# EAGLE design Gadget-Box-ESP8266 (EAGLE 6.6.0)

## Sheet 1 of 2
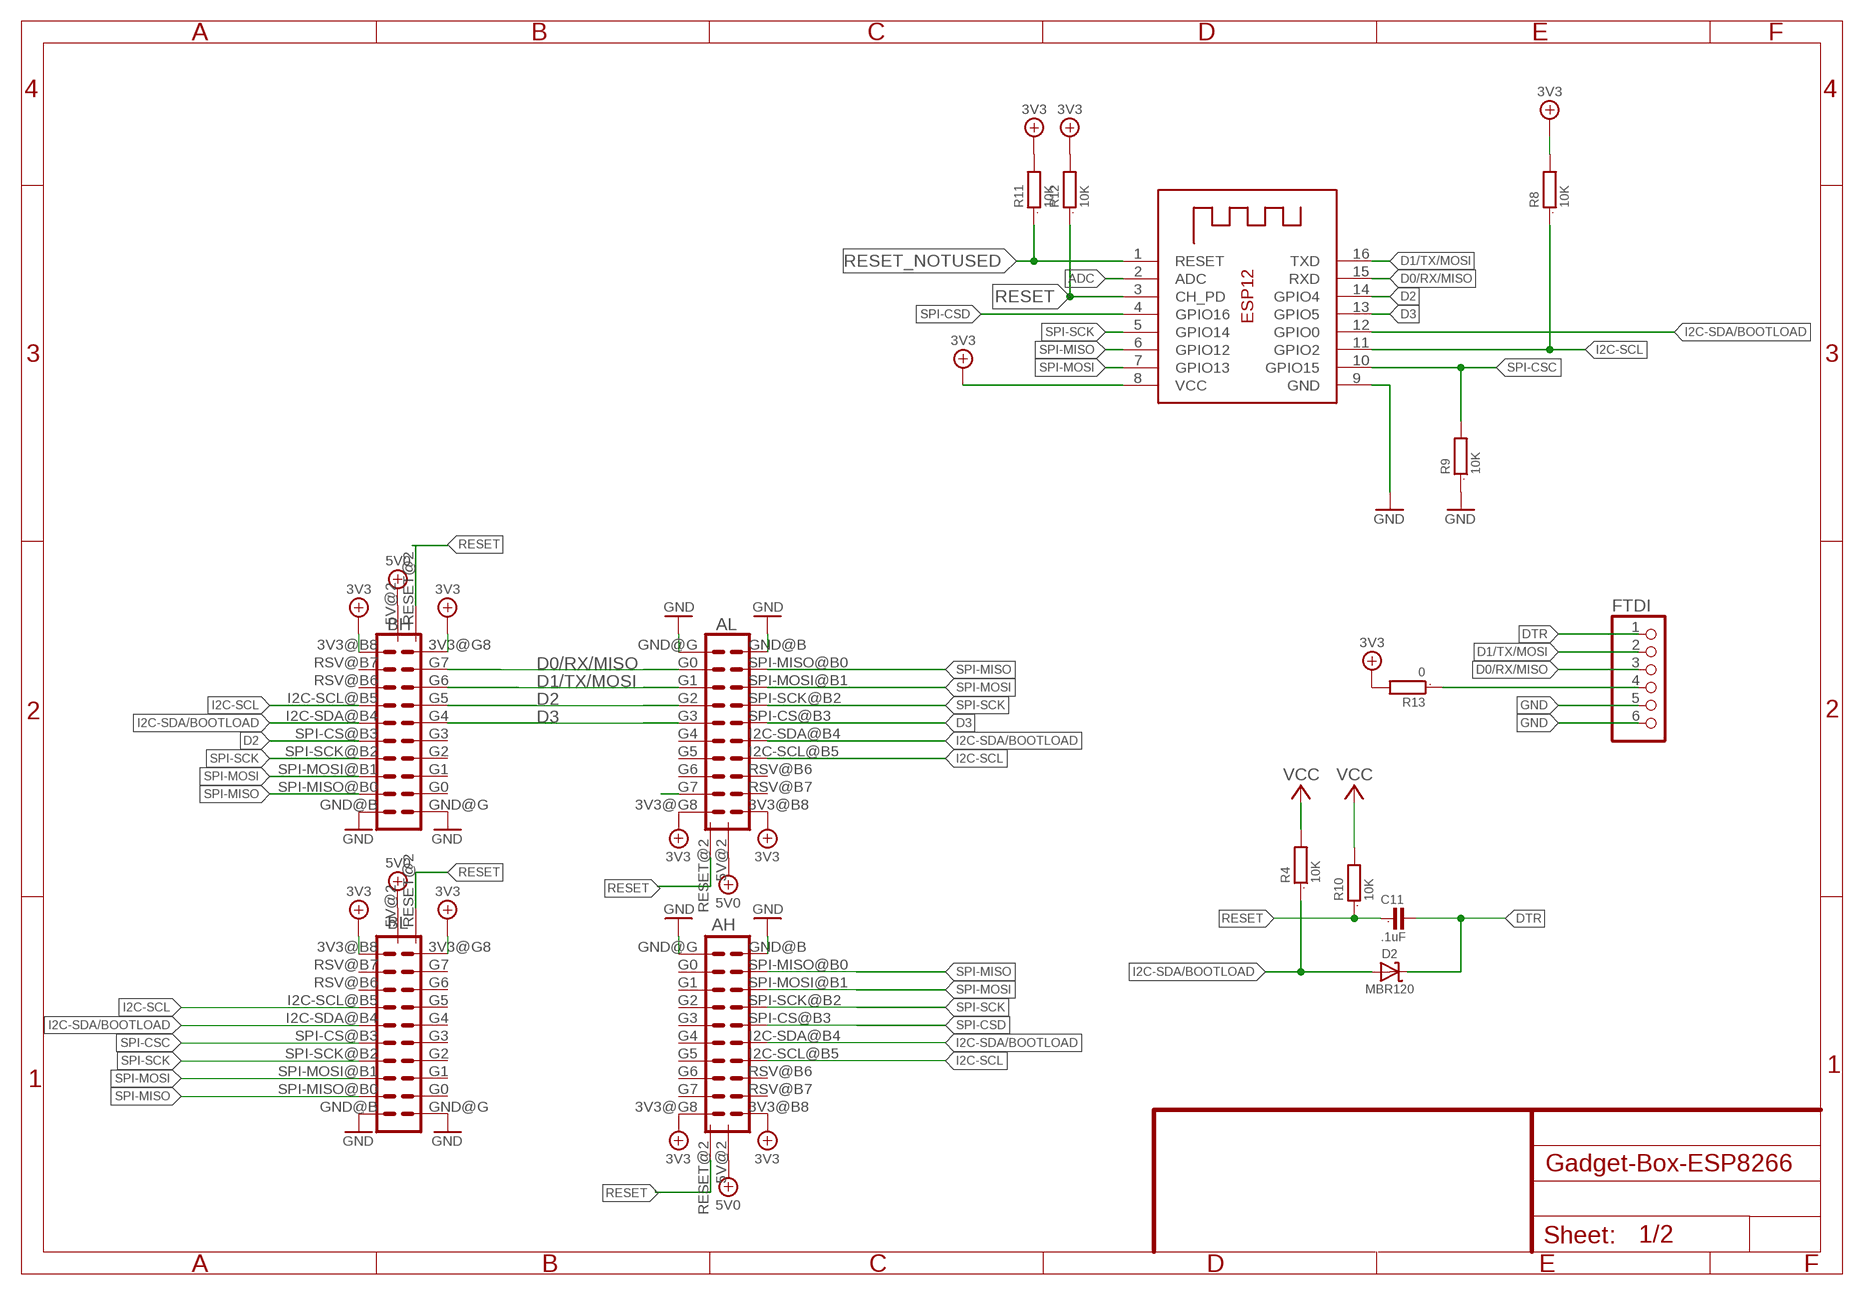
[diagram p0: schematic, sheet 1]

### Parts
AH  ECOGECOG_SLOT_ALT1  [ECOG_ALT1]
AL  ECOGECOG_SLOT_ALT1  [ECOG_ALT1]
BH  ECOGECOG_SLOT_ALT1  [ECOG_ALT1]
BL  ECOGECOG_SLOT_ALT1  [ECOG_ALT1]
C11  .1uF  C0805  [0805]
D2  MBR120  DIODE-SCHOTTKYSOD-123  [SOD-123]
FTDI  PINHD-1X6  [1X06]
R4  10K  R0805  [0805]
R8  10K  R0805  [0805]
R9  10K  R0805  [0805]
R10  10K  R0805  [0805]
R11  10K  R0805  [0805]
R12  10K  R0805  [0805]
R13  0  R0805  [0805]
X2  ESP-12  [ESP-12]

### Nets
3V3: AH.3V3@B8(3V3) AH.3V3@G8(3V3) AL.3V3@B8(3V3) AL.3V3@G8(3V3) BH.3V3@B8(3V3) BH.3V3@G8(3V3) BL.3V3@B8(3V3) BL.3V3@G8(3V3) R8.2 R10.2 R11.2 R12.2 R13.2 X2.8(VCC) ; supply symbol labelled VCC ; also sheet 2
5V0: AH.5V@2(5V) AL.5V@2(5V) BH.5V@2(5V) BL.5V@2(5V) ; also sheet 2
ADC: X2.2(ADC) ; also sheet 2
D0/RX/MISO: AL.G0 BH.G7 FTDI.3 X2.15(RXD)
D1/TX/MOSI: AL.G1 BH.G6 FTDI.2 X2.16(TXD)
D2: AL.G2 BH.G5 BH.SPI-CS@B3(SPI-CS) X2.14(GPIO4)
D3: AL.G3 AL.SPI-CS@B3(SPI-CS) BH.G4 X2.13(GPIO5)
DTR: C11.2 D2.C FTDI.1
GND [gnd]: AH.GND@B(GND) AH.GND@G(GND) AL.GND@B(GND) AL.GND@G(GND) BH.GND@B(GND) BH.GND@G(GND) BL.GND@B(GND) BL.GND@G(GND) FTDI.5 FTDI.6 R9.1 X2.9(GND) ; also sheet 2
I2C-SCL: AH.I2C-SCL@B5(I2C-SCL) AL.I2C-SCL@B5(I2C-SCL) BH.I2C-SCL@B5(I2C-SCL) BL.I2C-SCL@B5(I2C-SCL) R8.1 X2.11(GPIO2)
I2C-SDA/BOOTLOAD: AH.I2C-SDA@B4(I2C-SDA) AL.I2C-SDA@B4(I2C-SDA) BH.I2C-SDA@B4(I2C-SDA) BL.I2C-SDA@B4(I2C-SDA) D2.A R4.1 X2.12(GPIO0)
N$5: AL.G7
N$6: FTDI.4 R13.1
RESET: AH.RESET@2(RESET) AL.RESET@2(RESET) BH.RESET@2(RESET) BL.RESET@2(RESET) C11.1 R10.1 R12.1 X2.3(CH_PD)
RESET_NOTUSED: R11.1 X2.1(RESET)
SPI-CSC: BL.SPI-CS@B3(SPI-CS) R9.2 X2.10(GPIO15)
SPI-CSD: AH.SPI-CS@B3(SPI-CS) X2.4(GPIO16)
SPI-MISO: AH.SPI-MISO@B0(SPI-MISO) AL.SPI-MISO@B0(SPI-MISO) BH.SPI-MISO@B0(SPI-MISO) BL.SPI-MISO@B0(SPI-MISO) X2.6(GPIO12)
SPI-MOSI: AH.SPI-MOSI@B1(SPI-MOSI) AL.SPI-MOSI@B1(SPI-MOSI) BH.SPI-MOSI@B1(SPI-MOSI) BL.SPI-MOSI@B1(SPI-MOSI) X2.7(GPIO13)
SPI-SCK: AH.SPI-SCK@B2(SPI-SCK) AL.SPI-SCK@B2(SPI-SCK) BH.SPI-SCK@B2(SPI-SCK) BL.SPI-SCK@B2(SPI-SCK) X2.5(GPIO14)
VCC: R4.2
Unconnected: AH.G0 AH.G1 AH.G2 AH.G3 AH.G4 AH.G5 AH.G6 AH.G7 AH.RSV@B6(RSV) AH.RSV@B7(RSV) AL.G4 AL.G5 AL.G6 AL.RSV@B6(RSV) AL.RSV@B7(RSV) BH.G0 BH.G1 BH.G2 BH.G3 BH.RSV@B6(RSV) BH.RSV@B7(RSV) BL.G0 BL.G1 BL.G2 BL.G3 BL.G4 BL.G5 BL.G6 BL.G7 BL.RSV@B6(RSV) BL.RSV@B7(RSV)

## Sheet 2 of 2
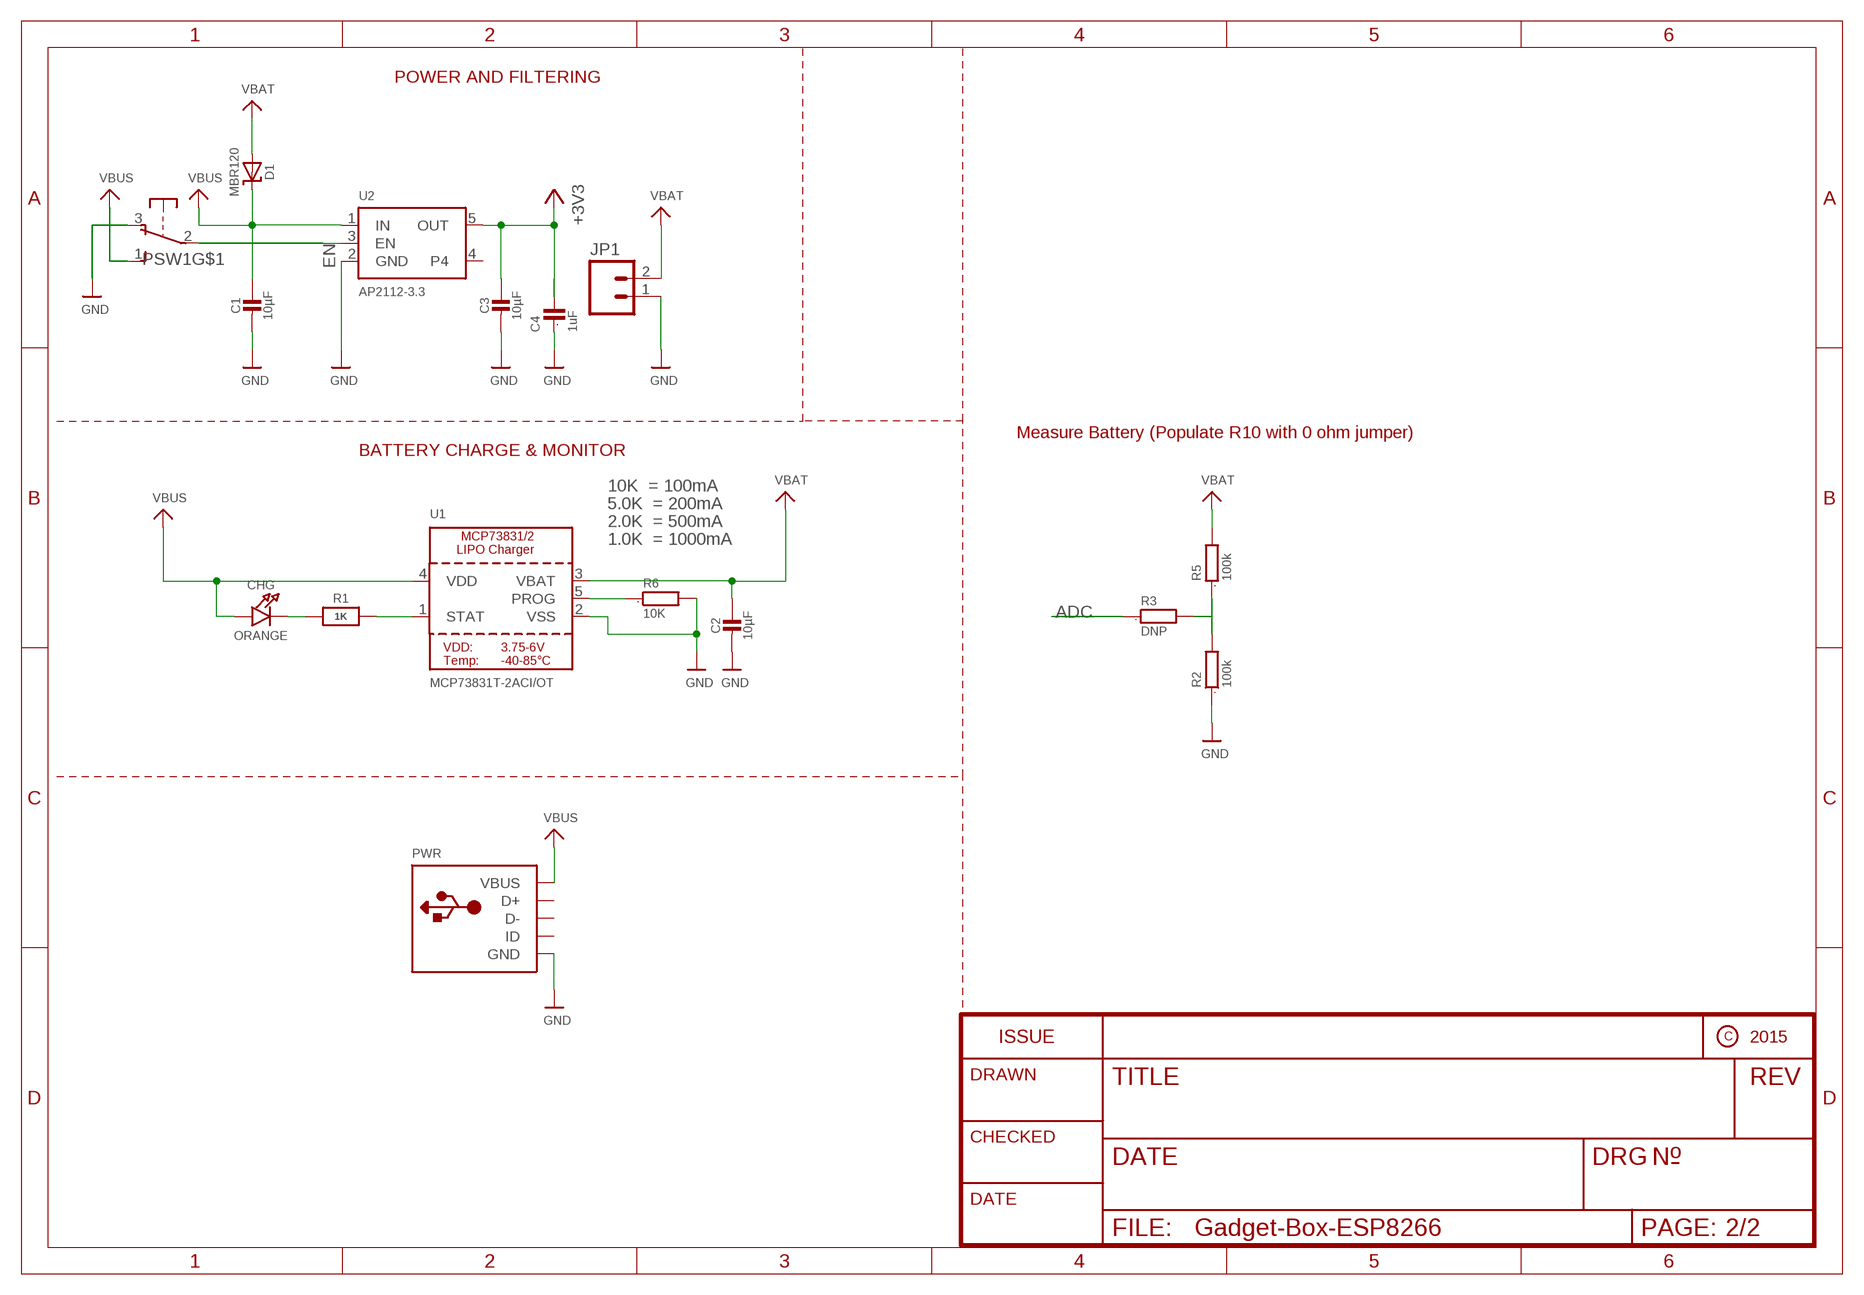
[diagram p1: schematic, sheet 2]

### Parts
C1  10µF  CAP_CERAMIC0805-NOOUTLINE  [0805-NO]
C2  10µF  CAP_CERAMIC0805-NOOUTLINE  [0805-NO]
C3  10µF  CAP_CERAMIC0805-NOOUTLINE  [0805-NO]
C4  1uF  C0603  [0603]
CHG  ORANGE  LED0805_NOOUTLINE  [CHIPLED_0805_NOOUTLINE]
D1  MBR120  DIODE-SCHOTTKYSOD-123  [SOD-123]
JP1  M02-JST-2-PTH-NO_SILK  [JST-2-PTH-NS]
PSW1  OS102011MA1Q  [OS102011MA1Q]
PWR  USBMINIB  [USB-MINIB]
R1  1K  RESISTOR_0603_NOOUT  [0603-NO]
R2  100k  R0603  [0603]
R3  DNP  R0603  [0603]
R5  100k  R0603  [0603]
R6  10K  R0603  [0603]
U1  MCP73831T-2ACI/OT  MCP73831/2  [SOT23-5]
U2  AP2112-3.3  VREG_SOT23-5  [SOT23-5]

### Nets
3V3: C3.1 C4.2 U2.5(OUT) ; supply symbol labelled +3V3 ; also sheet 1
5V0: C1.1 CHG.A D1.C PSW1.1(S) PWR.VBUS U1.4(VDD) U2.1(IN) ; supply symbol labelled VBUS ; also sheet 1
ADC: R3.1 ; also sheet 1
EN: PSW1.2(P) U2.3(EN)
GND [gnd]: C1.2 C2.2 C3.2 C4.1 JP1.1 PSW1.3(O) PWR.GND R2.1 R6.2 U1.2(VSS) U2.2(GND) ; also sheet 1
N$1: CHG.C R1.1
N$2: R2.2 R3.2 R5.1
N$3: R1.2 U1.1(STAT)
N$4: R6.1 U1.5(PROG)
VBAT: C2.1 D1.A JP1.2 R5.2 U1.3(VBAT)
Unconnected: PSW1.MT1(MT) PSW1.MT2(MT) PWR.D+ PWR.D- PWR.ID U2.4

### Notes on the sheet
- POWER AND FILTERING
- Measure Battery (Populate R10 with 0 ohm jumper)
- BATTERY CHARGE & MONITOR
- 10K  = 100mA
- 5.0K  = 200mA
- 2.0K  = 500mA
- 1.0K  = 1000mA

## Library data of the parts
AH AL BH BL = eCogs:ECOG; PARTNO: PPPC102LFBN-RC,SULLINS CONNECTOR SOLUTIONS,dk,S6106-ND,"CONN HEADER FEM 20POS.1"" DL GOLD", REF67
C1-C3 = microbuilder:CAP_CERAMIC: Ceramic Capacitors For new designs, use the packages preceded by an '_' character since they are more reliable: The following footprints should be used on most boards: _0402 - Standard footprint for regular board layouts _0603 - Standard footprint for regular board layouts _0805 - Standard footprint for regular board layouts _1206 - Standard footprint for regular board layouts For extremely tight-pitch boards where space is at a premium, the following 'micro-pitch' footprints can be used (smaller pads, no silkscreen outline, etc.): _0402MP - Micro-pitch footprint for very dense/compact boards _0603MP - Micro-pitch footprint for very dense/compact boards _0805MP - Micro-pitch footprint for very dense/compact boards _1206MP - Micro-pitch footprint for very dense/compact boards; PARTNO: CL21F106ZPFNNNE,Samsung,DK,1276-3012-1-ND,CAP CER 10UF 10V Y5V 0805, REF1
C4 = GadgetFactory:C: CAPACITOR, European symbol; PARTNO: C1608X5R1A105K080AC,TDK CORPORATION (VA),dk,445-1321-1-ND,CAP CER 1UF 10V X5R 0603, REF53
C11 = GadgetFactory:C: CAPACITOR, European symbol; PARTNO: GRM21BR71E104KA01L,MURATA ELECTRONICS (VA),DK,490-1673-1-ND,CAP CER .1UF 25V 10% X7R 0805, REF3
CHG = microbuilder:LED: LED 0603 - 0603 Surface Mount Package 2mA: Green LED - Low Power (3.9mcd, 2ma, 1.7Vf) - Digikey: 475-2709-2-ND Orange LED - Low Power (9.8mcd, 2ma, 1.8Vf) - Digikey: 475-1194-2-ND Red LED - Low Power (5mcd, 2ma, 1.8Vf) - Digikey: 475-1195-2-ND Yellow LED - Low Power (7mcd, 2ma, 1.8Vf) - Digikey: 475-1196-2-ND 5mA: Blue LED - Low Power (17mcd, 5ma, 2.9Vf) - Digikey: LNJ937W8CRACT-ND 0805 - 0805 Surface Mount Package 2mA: Red LED (8.8mcd, 2mA, 1.8Vf, Clear) - Low Power [Digikey: 475-2510-1-ND] Green LED (5mcd, 2mA, 1.8Vf, Clear) - Low Power [Digikey: 475-2730-1-ND] Yellow LED (11.3mcd, 2mA, 1.8Vf, Clear) - Low Power [Digikey: 475-2555-1-ND] 20mA: Red LED (104mcd, 20mA, Diffused) - LS R976 [Digikey: 475-1278-6-ND] Red LED (12mcd, 20mA, 2.0Vf, Clear) - APT2012EC [Digikey: 754-1128-1-ND] Green LED (15mcd, 20mA, 2.2Vf, Clear) - APT2012GC [Digikey: 754-1131-1-ND] Orange LED (160mcd, 20mA, 2.1Vf, Clear) - APT2012SECK [Digikey: 754-1130-1-ND] 1206 - 1206 Surface Mount Package Green LED (26mcd, 20mA, Diffused) - LG N971 [Digikey: 475-1407-6-ND] Red LED (15mcd, 20mA, Diffused) - LH N974 [Digikey: 475-1416-6-ND] Cree - Cree High-Power Surface Mount LEDs XPEBWT-L1-0000-00D50 - White 111lm 350mA 2.9Vf 6200K 110° XTEAWT-00-0000-00000LEE3 - White 114lm 350mA 2.85Vf 5000K 115° Everlight - Everlight 45-21 Series Surface Mount LEDs 45-21/QK2C-B2832AC2CB2/2T - Warm White 2000mcd 20mA 3.25Vf 3050K 120° 45-21/LK2C-B38452C4CB2/2T - Nuetral White 2000mcd 20mA 3.25Vf 4150K 120° 45-21/LK2C-B50634C6CB2/2T - Cold White 2200mcd 20mA 3.25Vf 5650K 120° PLCC2 Reverse Mount LS T77K-J1L2-1-0-2-R18-Z - Red 11.25mcd 2mA 1.8Vf 630nm 120° LO T77K-L1M2-24-Z - Orange 19.6mcd 2mA 1.8Vf 606nm 120° LY T77K-K2M1-26-Z - Yellow 15.7mcd 2mA 1.8Vf 587nm 120°; PARTNO: LTST-C171EKT,LITE-ON INC (VA),DK,160-1422-1-ND,LED RED ORAN CLEAR THIN 0805 SMD, REF6
D1 D2 = microbuilder:DIODE-SCHOTTKY; PARTNO: MBR120VLSFT3G,on semiconductor,dk,MBR120VLSFT3GOSCT-ND ,DIODE SCHOTTKY 20V 1A SOD123FL , REF71
FTDI = GadgetFactory:PINHD-1X6: PIN HEADER; PARTNO: PPPC061LGBN-RC,SULLINS CONNECTOR SOLUTIONS,dk,S5481-ND ,"6 Position Header Connector 0.100"" (2.54mm) Through Hole - Right Angle Gold ", REF91
JP1 = SparkFun:M02: Header 2 Standard 2-pin 0.1" header. Use with straight break away headers (SKU : PRT-00116), right angle break away headers (PRT-00553), swiss pins (PRT-00743), machine pins (PRT-00117), and female headers (PRT-00115). Molex polarized connector foot print use with SKU : PRT-08233 with associated crimp pins and housings.; PARTNO: B2B-PH-SM4-TB(LF)(SN),JST SALES AMERICA INC (VA),dk,455-1734-1-ND ,"2 Positions Header, Shrouded Connector 0.079 (2.00mm) Through Hole Tin ", REF87
PSW1 = adafruit:OS102011MA1Q: OS10201MA1Q through-hole right angle switch http://www.ladyada.net/library/eagle; PARTNO: OS102011MA1QN1,C&K Components,dk,CKN9559-ND,SWITCH SLIDE SPDT 100MA 12V , REF72
PWR = adafruit:USB: USB Connectors USBMINIB - Surface Mount Female Mini-B USB Connector 4UConnector: 06564 By microbuilder.eu Thru-hole RA Female Mini-B USB Connector 4UConnector: 18732 By ladyada.net; PARTNO: USB-M26FTR,On Shore Technology Inc,DK,ED2992CT-ND,MINI-USB-B Connector, REF22
R1 = microbuilder:RESISTOR: Resistors For new designs, use the packages preceded by an '_' character since they are more reliable: The following footprints should be used on most boards: _0402 - Standard footprint for regular board layouts _0603 - Standard footprint for regular board layouts _0805 - Standard footprint for regular board layouts _1206 - Standard footprint for regular board layouts For extremely tight-pitch boards where space is at a premium, the following 'micro-pitch' footprints can be used (smaller pads, no silkscreen outline, etc.): _0402MP - Micro-pitch footprint for very dense/compact boards _0603MP - Micro-pitch footprint for very dense/compact boards _0805MP - Micro-pitch footprint for very dense/compact boards _1206MP - Micro-pitch footprint for very dense/compact boards; PARTNO: RC0603JR-071KL,YAGEO (VA),dk,311-1.0KGRTR-ND,RES SMD 1K OHM 5% 1/10W 0603 , REF73
R2 R5 = GadgetFactory:R: RESISTOR, European symbol; PARTNO: RC0603JR-07100KL,YAGEO (VA),dk,311-100KGRCT-ND,RES SMD 100K OHM 5% 1/10W 0603 , REF76
R3 R13 = GadgetFactory:R: RESISTOR, European symbol; BOM: EXCLUDE
R4 R6 R10 = GadgetFactory:R: RESISTOR, European symbol; PARTNO: RC0603JR-0710KL,YAGEO (VA),dk,311-10KGRCT-ND,RES SMD 10K OHM 5% 1/10W 0603 , REF36
R8 R9 R11 R12 = GadgetFactory:R: RESISTOR, European symbol; DIGIKEY: RMCF0805JT10K0CT-ND
U1 = microbuilder:MCP73831/2: MCP73831/2 LIPO Charger VDD: 3.75 - 6V Temp -40 - 85°C Programmable Charge Rate: 15-500mA NOTE: STAT is a tri-state logic output on the MCP73831 and an open-drain output on the MCP73832. SOT23-5 with 4.2V output and tri-state logic on STAT = MCP73831T-2ACI/OT; PARTNO: MCP73831T-2ACI/OT,MICROCHIP TECHNOLOGY (VA),dk,MCP73831T-2ACI/OTCT-ND,IC CONTROLLR LI-ION 4.2V SOT23-5, REF74
U2 = microbuilder:VREG_SOT23-5: SOT23-5 Fixed Voltage Regulators Part Current Out V Out V In V Dropout θJA (°C/W) TJ (°C) Digikey Part No. ADP121 150mA 3.3V 3.4-5.5V 0.09V @ 150mA -- -- ADP121-AUJZ33R7CT-ND ADP121 150mA 3.0V 3.1-5.5V 0.09V @ 150mA -- -- ADP121-AUJZ30R7CT-ND ADP122 300mA 3.3V 3.4-5.5V 0.085V @ 300mA -- -- ADP122AUJZ-3.3-R7CT-ND ADP1712 300mA 3.3V 3.5-5.5V 0.17V @ 300mA -- -- ADP1712AUJZ-3.3-R7TR-ND AP7311 (Low Cost) 150mA 3.3V 3.5-6V 0.15V @ 150mA -- -- AP7311-33WG-7DICT-ND LD39015M18R 150mA 1.8V 1.9V-5.5V 0.08V @ 100mA -- -- 497-6977-1-ND LP2985A-33DBVR 150mA 3.3V 3.3-16V 0.28V @ 150mA 206 150 296-18479-1-ND MCP1824T-3302E/OT 300mA 3.3V 3.5V-6V 0.2V @ 300mA -- -- MCP1824T-3302E/OTCT-ND MIC5205-2.5YM5 TR 150mA 2.5V 2.7-16V 0.165V @ 150mA -- -- 576-1257-2-ND MIC5205-3.0YM5 TR 150mA 3.0V 3.2V-16V 0.165V @ 150mA -- -- 576-1258-2-ND MIC5205-3.3YM5 TR 150mA 3.3V 3.5V-16V 0.165V @ 150mA -- -- 576-1259-2-ND TPS780330220 150mA 3.3V+2.2V 3.6-5.5V 250mV Max -- -- 296-23332-1-ND TDA3663/N1,135 100mA 3.3V 3.5-45V 0.18V @ 50mA -- -- 568-5343-1-ND Max operating temp can be calculated using θJA, TJ (max junction temperature), and power in watts. Set the "Maximum Ambient Temperature" until it reaches TJ ("Max Junction Temperature"), which is the absolute limit for safe use of the regulator: Heat Sink Temperature Calculator <http://www.daycounter.com/Calculators/Heat-Sink-Temperature-Calculator.phtml> For example, With 12V source into a 3.3V LP2985 and a 30mA load, we are dissipating (12V-3.3V) * 0.03A = 0.261W. With a θJA of 206 °C/W, a TJ of 150°C, and 261mW we can safely use the chip without a heat sink up to 75°C (=147.1°C Junction Temperature).; PARTNO: AP2112K-3.3TRG1,Diodes Incorporated,dk,AP2112K-3.3TRG1DICT-ND,IC REG LDO 3.3V 0.6A SOT25 , REF75
X2 = adafruit:ESP-12; ADAFRUIT: 2491

## Net classes
2 gnd: width 0.254 mm, drill 0.381 mm, clearance 0.254 mm
3 usbvcc: width 0.254 mm, drill 0.381 mm, clearance 0.254 mm
4 aref: width 0.254 mm, drill 0.381 mm, clearance 0.254 mm

## Board
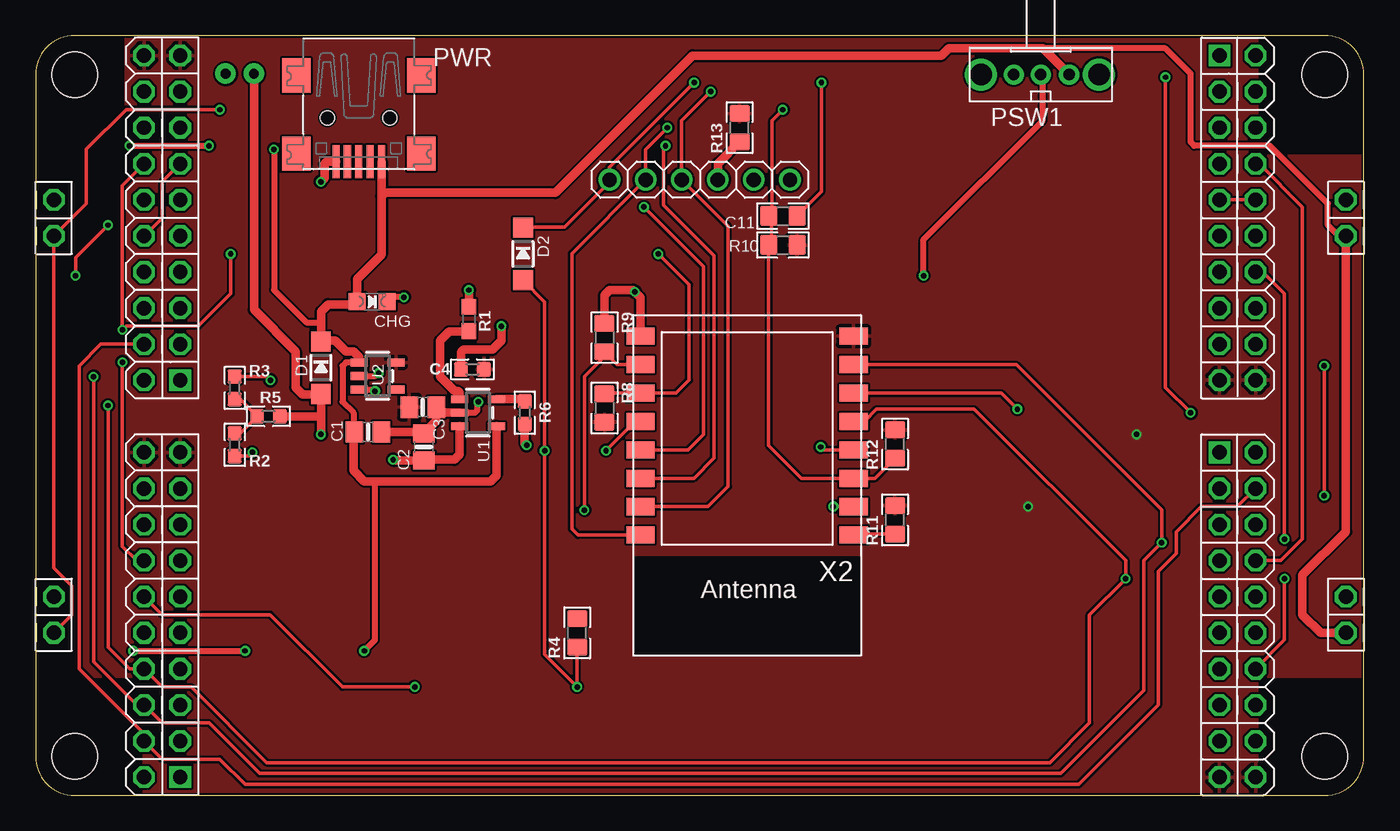
[diagram p2: board, top side]
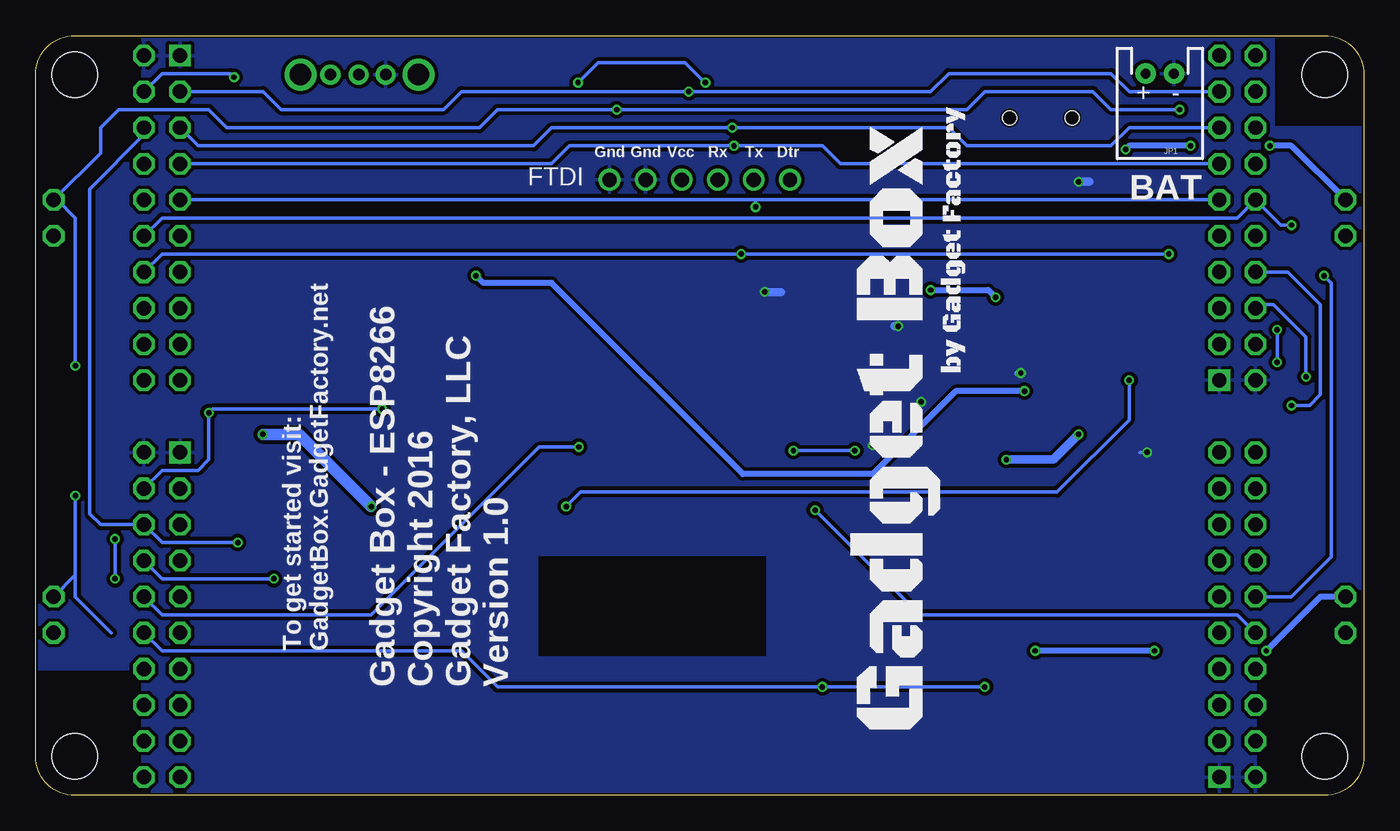
[diagram p3: board, bottom side, seen from below]

Size 93.5 x 53.5 mm. Coordinates in mm from the lower left corner, seen from the top.
Copper layers (1*16): Top 0.035mm / dielectric 1.5mm / Bottom 0.035mm
Design rules "hackvana *": minimum track width 6mil, minimum drill 0.3mm, track to track 6mil, track to pad 6mil, pad to pad 6mil, via to via 6mil, smd to smd 0mil, copper to edge 6mil, drill to drill 6mil, minimum pad ring 10mil, minimum via ring 6mil, stop-mask expansion 2mil, vias tented up to drill 100mil, thermal gap 10mil

### Footprints (pad centres in the part's own frame; a part is rotated, then mirrored left to right if it is on the bottom)
ECOG93P53P5 = hole 3.2: 4,4; 92,4; 92,52; 4,52
ECOG_ALT1 = drill 1.016 octagon: 3V3@B8 21.59,3.81; 3V3@G8 21.59,1.27; 5V@2 11.43,10.16; G0 1.27,1.27; G1 3.81,1.27; G2 6.35,1.27; G3 8.89,1.27; G4 11.43,1.27; G5 13.97,1.27; G6 16.51,1.27; G7 19.05,1.27; GND@B -1.27,3.81; I2C-SCL@B5 13.97,3.81; I2C-SDA@B4 11.43,3.81; RESET@2 8.89,10.16; RSV@B6 16.51,3.81; RSV@B7 19.05,3.81; SPI-CS@B3 8.89,3.81; SPI-MISO@B0 1.27,3.81; SPI-MOSI@B1 3.81,3.81; SPI-SCK@B2 6.35,3.81 | drill 1.016 square: GND@G -1.27,1.27
0805-NO = smd 1.24 x 1.5: 1 -0.95,0; 2 0.95,0
0603 = smd 1 x 1: 1 -0.8,0; 2 0.8,0
0805 = smd 1.2 x 1.4: 1 -1,0; 2 1,0
CHIPLED_0805_NOOUTLINE = smd 1.2 x 1.2: A 0,-1.05; C 0,1.05
SOD-123 = smd 1.4 x 1.4: A 1.85,0; C -1.85,0
1X06 = drill 1.016: 1 -6.35,0; 2 -3.81,0; 3 -1.27,0; 4 1.27,0; 5 3.81,0; 6 6.35,0
JST-2-PTH-NS = drill 0.7 pad 1.448: 1 -1,0; 2 1,0
OS102011MA1Q = drill 0.8 pad 1.422: 1 -2,0; 2 0,0; 3 1.9,0 | drill 1.5 pad 2.184: MT1 -4.1,0; MT2 4.2,0
USB-MINIB = smd 0.5 x 2.308: D+ 0,4.064; D- -0.8,4.064; GND 1.6,4.064; ID 0.8,4.064; VBUS -1.6,4.064 | smd 2 x 2.4: GND1 -4.4,-2; GND2 -4.4,3.5; GND3 4.4,3.5; GND4 4.4,-2 | hole 1: -2.2,1; 2.2,1
0603-NO = smd 1.1 x 1: 1 -0.85,0; 2 0.85,0
SOT23-5 = smd 0.55 x 1.2: 1 -0.95,-1.3; 2 0,-1.3; 3 0.95,-1.3; 4 0.95,1.3; 5 -0.95,1.3
ESP-12 = smd 2 x 1.2: 1 -7.5,4.5; 2 -7.5,2.5; 3 -7.5,0.5; 4 -7.5,-1.5; 5 -7.5,-3.5; 6 -7.5,-5.5; 7 -7.5,-7.5; 8 -7.5,-9.5; 9 7.5,-9.5; 10 7.5,-7.5; 11 7.5,-5.5; 12 7.5,-3.5; 13 7.5,-1.5; 14 7.5,0.5; 15 7.5,2.5; 16 7.5,4.5

### Placement (x,y rotation side)
$$U$1  [ECOG93P53P5]  -1.25,-1.25 0 top
AH  82.06,22.88 270 top
AL  82.06,50.82 270 top
BH  11.45,30.5 90 top
BL  11.45,2.56 90 top
C1  23.39,25.59 0 top
C2  27.32,24.53 90 top
C3  27.26,27.34 0 top
C4  30.75,29.99 0 top
C11  52.6,40.79 0 top
CHG  23.68,34.76 270 top
D1  20.09,30.12 270 top
D2  34.31,38.12 270 top
FTDI  46.75,43.35 0 top
JP1  14.37,50.82 180 bottom
PSW1  70.75,50.75 180 top
PWR  22.75,48.69 180 top
R1  30.5,33.55 270 top
R2  14.02,24.69 90 top
R3  14.02,28.69 270 top
R4  38.12,11.45 90 top
R5  16.4,26.69 0 top
R6  34.44,26.94 270 top
R8  40.05,27.27 270 top
R9  40.05,32.23 270 top
R10  52.6,38.76 0 top
R11  60.49,19.4 90 top
R12  60.49,24.73 90 top
R13  49.55,47.01 90 top
U1  31.13,26.94 270 top
U2  24.07,29.53 270 top
U$100  [GADGETBOX_TEXT]  32.79,25.93 90 bottom
X2  50.08,22.83 180 top

### Tracks (layer width: path | path; a pad name or v marks a point on that pad's centre or on a via)
3V3  (via drill 0.38)
  Top 0.813: 57.67,32.42 X2.8
  Bottom 0.813: v77.49,25.42 74.95,25.42 v69.87,20.34
  pour Top: -1.25,8.37 -1.25,47.03 6.37,47.03 6.37,54.63 85.95,54.63 85.95,45.01 94.92,45.01 94.92,8.37 85.95,8.37 85.95,-1.25 7.64,-1.25 7.64,8.37
5V0  (via drill 0.38)
  Top 0.406: U2.1 21.85,30.48 21.61,30.25 21.61,27.71 22.37,26.94 22.37,25.66 C1.1 | AL.5V@2 91.71,39.39 90.95,40.15 90.95,41.68 86.89,45.74 81.55,45.74 81.3,45.99 81.3,50.82 79.52,52.6 70.9,52.6 | 23.64,22.12 23.9,21.86 23.9,10.94 v23.13,10.18 | v6.88,10.18 v14.75,10.18 | v16.78,45.49 16.78,35.58 19.07,33.29 20.09,33.29 | v6.62,45.74 v12.21,45.74
  Top 0.61: U2.1 22.77,30.86 22.37,31.26 21.86,31.26 21.1,32.02 20.14,32.02 D1.C 20.09,33.29 20.09,34.06 20.59,34.56 22.44,34.56 CHG.A 22.63,34.77 22.63,36.34 24.35,38.07 24.35,42.18 | U1.4 32.44,22.53 32.02,22.12 23.64,22.12 23.13,22.12 22.37,22.88 22.37,25.52 C1.1 | PWR.VBUS 24.35,42.18 | 24.35,42.18 24.6,42.44 36.6,42.44 46.25,52.09 63.77,52.09 64.28,52.6 70.9,52.6 PSW1.1 | AH.5V@2 90.44,11.45 89.17,12.72 89.17,15.51 92.22,18.56 AL.5V@2
  Bottom 0.406: BL.5V@2 3.07,13.99 v6.88,10.18 | v14.75,10.18 v23.13,10.18 | BH.5V@2 5.1,45.74 v6.62,45.74 | v12.21,45.74 16.53,45.74 v16.78,45.49
ADC  (via drill 0.38)
  Top 0.254: R3.1 16.27,29.49 v16.53,29.23 | v56.15,20.34 X2.2
  Bottom 0.254: v16.53,29.23 16.53,26.44 21.61,21.36 55.14,21.36 v56.15,20.34
D0/RX/MISO  (via drill 0.38)
  Top 0.254: v47.52,49.55 45.48,47.51 FTDI.3 48.75,40.08 48.75,21.75 47.33,20.33 X2.15
  Bottom 0.254: AL.G0 77.49,49.55 76.22,48.28 64.79,48.28 63.52,49.55 v47.52,49.55 30.5,49.55 29.23,50.82 17.8,50.82 16.53,49.55 BH.G7
D1/TX/MOSI  (via drill 0.38)
  Top 0.254: v44.47,47.01 42.94,45.48 FTDI.2 37.75,38.16 37.75,18.75 38.17,18.33 X2.16
  Bottom 0.254: BH.G6 16.53,47.01 17.8,45.74 27.96,45.74 29.23,47.01 v44.47,47.01 57.17,47.01 58.44,45.74 82.06,45.74 AL.G1
D2  (via drill 0.38)
  Top 0.254: X2.14 46.33,22.33 47.75,23.75 47.75,38.02 44.22,41.55 44.22,45.61 v44.34,45.74 | BH.SPI-CS@B3 8.91,40.66 8.91,43.2 BH.G5
  Bottom 0.254: AL.G2 57.17,44.47 55.9,45.74 v44.34,45.74 38.12,45.74 36.85,44.47 BH.G5
D3  (via drill 0.38)
  Top 0.254: X2.13 45.92,24.33 47.01,25.42 47.01,37.23 v42.82,41.42 | AL.G3 AL.SPI-CS@B3
  Bottom 0.254: BH.G4 42.82,41.93 | 42.82,41.93 AL.G3 | v42.82,41.42 42.82,41.93
DTR  (via drill 0.38)
  Top 0.254: v46.35,50.19 40.4,44.23 FTDI.1 40.4,43.19 37.23,40.02 34.37,40.02 D2.C | v55.32,50.19 55.32,42.51 C11.2
  Bottom 0.254: v46.35,50.19 46.38,50.19 47.77,51.58 53.92,51.58 v55.32,50.19
EN  (via drill 0.38)
  Top 0.406: U2.3 23.78,28.59 v23.9,28.47 | v62.5,36.6 62.5,39.14 70.89,47.52 70.89,50.61 PSW1.2
  Bottom 0.406: v23.9,28.47 28.72,28.47 34.56,22.63 43.71,22.63 57.17,36.09 62,36.09 v62.5,36.6
GND  (via drill 0.38)
  Top 0.254: R2.1 15,23.89 v15.26,24.15
  Top 0.406: U1.2 30.93,26.94 31.11,27.12 31.11,27.66 v31.16,27.71 | U2.2 23.95,29.54 v24.15,29.74
  Top 0.61: C1.2 27.22,25.59 C2.2 28.21,26.36 C3.2 28.6,26.94 U1.2 | v20.09,43.2 20.34,43.45 20.34,44.47 20.49,44.62 PWR.GND | C4.1 29.95,31.22 30.12,31.39 32.15,31.39 32.79,32.02 v32.79,33.04 | X2.9 42.58,35.06 v42.18,35.45 42.06,35.58 40.41,35.58 40.05,35.22 R9.1 | R6.2 34.44,24.79 v34.56,24.66
  Bottom 0.254: 15.77,24.15 v15.26,24.15
  Bottom 0.406: v24.15,29.74 24.4,29.74
  Bottom 0.61: v20.09,43.2 19.32,43.2 | v32.79,33.04 33.04,33.04 | v42.18,35.45 41.04,35.45
  pour Bottom: -1.25,8.4 -1.25,47.01 6.37,47.01 6.37,55.14 85.95,55.14 85.95,44.47 94.92,44.47 94.92,8.91 85.95,8.91 85.95,-1.76 7.64,-1.76 7.64,8.4
I2C-SCL  (via drill 0.38)
  Top 0.254: BL.I2C-SCL@B5 7.13,16.53 6.12,17.55 v6.12,30.5 | BH.I2C-SCL@B5 6.12,42.95 v6.12,32.79 6.37,33.04 11.45,33.04 13.74,35.33 v13.74,38.12 | R8.1 40.1,28.33 X2.11 45.09,28.33 45.99,29.23 45.99,35.96 v43.84,38.12 | AL.I2C-SCL@B5 86.38,36.85 87.9,35.33 v87.9,18.05 | v87.9,15.26 87.9,10.94 AH.I2C-SCL@B5
  Bottom 0.254: AL.I2C-SCL@B5 84.6,38.12 v43.84,38.12 v13.74,38.12 | v6.12,30.5 v6.12,32.79 | v87.9,18.05 v87.9,15.26
I2C-SDA/BOOTLOAD  (via drill 0.38)
  Top 0.254: X2.12 42.2,26.33 v40.15,24.28 | v26.69,7.64 21.61,7.64 16.53,12.72 8.91,12.72 BL.I2C-SDA@B4 | v2.81,36.6 2.81,37.87 v5.1,40.15 | D2.A 35.83,34.75 v35.83,24.28 35.83,9.93 v38.12,7.64 R4.1
  Bottom 0.254: v40.15,24.28 v35.83,24.28 | AL.I2C-SDA@B4 84.6,40.66 8.91,40.66 BH.I2C-SDA@B4 5.86,40.15 v5.1,40.15 | BL.I2C-SDA@B4 5.1,13.99 2.31,16.78 2.31,36.09 v2.81,36.6 | AH.I2C-SDA@B4 84.6,10.18 63.52,10.18 60.98,7.64 v38.12,7.64 v26.69,7.64
N$1  (via drill 0.38)
  Top 0.406: v25.93,35.07 25.05,35.07 CHG.C
  Top 0.61: v30.5,35.58 R1.1
  Bottom 0.406: v30.5,35.58 26.44,35.58 v25.93,35.07
N$2
  Top 0.254: R3.2 14.4,27.89 R5.1 14.4,25.49 R2.2
N$3
  Top 0.61: U1.1 29.84,28.37 29.74,28.47 29.48,28.47 28.47,29.48 28.47,32.02 29.1,32.66 30.46,32.66 R1.2
N$4
  Top 0.61: U1.5 34.29,27.89 R6.1
N$6
  Top 0.61: FTDI.4 48.02,44.48 R13.1
RESET  (via drill 0.38)
  Top 0.254: v52.6,48.28 51.84,47.52 51.84,41.02 C11.1 51.8,40.59 51.8,38.95 R10.1 51.6,24.64 53.91,22.33 X2.3 59.09,22.33 R12.1 | v90.7,30.25 v90.7,21.1 | BL.RESET@2 2.56,12.72 2.56,14.75 1.29,16.02 BH.RESET@2 3.58,41.68 3.58,45.49 6.37,48.28 v12.97,48.28
  Bottom 0.254: v12.97,48.28 17.8,48.28 19.07,49.55 26.69,49.55 27.96,48.28 v52.6,48.28 60.98,48.28 62.25,47.01 80.03,47.01 81.3,48.28 87.65,48.28 88.92,47.01 88.92,45.23 AL.RESET@2 91.97,41.93 90.7,40.66 v90.7,30.25 | v90.7,21.1 90.7,15.51 | 90.7,15.51 AH.RESET@2 | 90.7,15.51 90.7,13.99 88.16,11.45
RESET_NOTUSED
  Top 0.254: R11.1 57.65,18.4 X2.1
SPI-CSC  (via drill 0.38)
  Top 0.254: X2.10 40.95,30.33 R9.2 40.05,30.9 38.63,29.48 v38.63,20.09
  Bottom 0.254: BL.SPI-CS@B3 8.91,12.72 31.26,12.72 v38.63,20.09
SPI-CSD  (via drill 0.38)
  Top 0.254: X2.4 55.47,24.33 v55.27,24.53
  Bottom 0.254: v55.27,24.53 58.06,24.53 69.87,12.72 84.6,12.72 AH.SPI-CS@B3
SPI-MISO  (via drill 0.38)
  Top 0.254: AH.SPI-MISO@B0 84.6,20.34 82.06,20.34 80.28,18.56 80.28,17.04 79.01,15.77 79.01,6.37 73.43,0.78 14.75,0.78 12.97,2.56 8.91,2.56 BL.SPI-MISO@B0 7.64,4.34 3.07,8.91 3.07,30.25 4.59,31.77 BH.SPI-MISO@B0 | v79.52,50.57 79.52,28.72 v81.3,26.94 | X2.6 67.98,28.33 v69.11,27.2
  Bottom 0.254: AL.SPI-MISO@B0 84.6,50.82 79.78,50.82 v79.52,50.57 | AH.SPI-MISO@B0 84.6,22.88 82.06,22.88 81.3,23.64 v81.3,26.94 81.05,27.2 v69.11,27.2
SPI-MOSI  (via drill 0.38)
  Top 0.254: v4.08,29.48 4.08,9.42 7.13,6.37 BL.SPI-MOSI@B1 8.91,5.1 12.21,5.1 15.77,1.54 72.16,1.54 78,7.39 78,16.53 v79.27,17.8 79.27,20.09 69.02,30.33 X2.7
  Bottom 0.254: v79.27,17.8 84.6,17.8 AH.SPI-MOSI@B1 88.92,19.07 89.68,19.83 89.68,42.69 85.87,46.5 AL.SPI-MOSI@B1 | v4.08,29.48 4.08,32.28 6.37,34.56 7.39,34.56 BH.SPI-MOSI@B1
SPI-SCK  (via drill 0.38)
  Top 0.254: v5.1,27.45 5.1,10.43 6.62,8.91 BL.SPI-SCK@B2 8.91,7.64 10.94,7.64 16.28,2.31 71.39,2.31 74.19,5.1 74.19,12.72 v76.73,15.26 76.73,16.53 66.06,27.2 59.2,27.2 58.33,26.33 X2.5 | AL.SPI-SCK@B2 86.13,44.47 89.17,41.42 89.17,18.05 87.65,16.53 AH.SPI-SCK@B2
  Bottom 0.254: v76.73,15.26 84.6,15.26 AH.SPI-SCK@B2 | v5.1,27.45 3.83,27.45 3.07,28.21 3.07,34.56 5.35,36.85 BH.SPI-SCK@B2
VBAT  (via drill 0.38)
  Top 0.61: U1.3 29.84,23.99 29.48,23.64 27.39,23.64 C2.1 25.23,23.58 v25.17,23.64 | v20.09,25.42 20.09,26.69 | 20.09,26.69 D1.A 20.03,28.21 18.82,28.21 18.31,28.72 18.31,31.26 15.37,34.2 JP1.2 | R5.2 20.08,26.69 20.09,26.69
  Bottom 0.61: v25.17,23.64 21.86,23.64 v20.09,25.42

### Text on the board
bPlace: Dtr | Tx | Rx | Vcc | Gnd | Gnd | BAT | To get started visit: / GadgetBox.GadgetFactory.net | Gadget Box - ESP8266 / Copyright 2016 / Gadget Factory, LLC / Version 1.0
Reference: TOP Silkscreen is on layer 200